# EAGLE schematic Schematic (EAGLE 9.6.2)
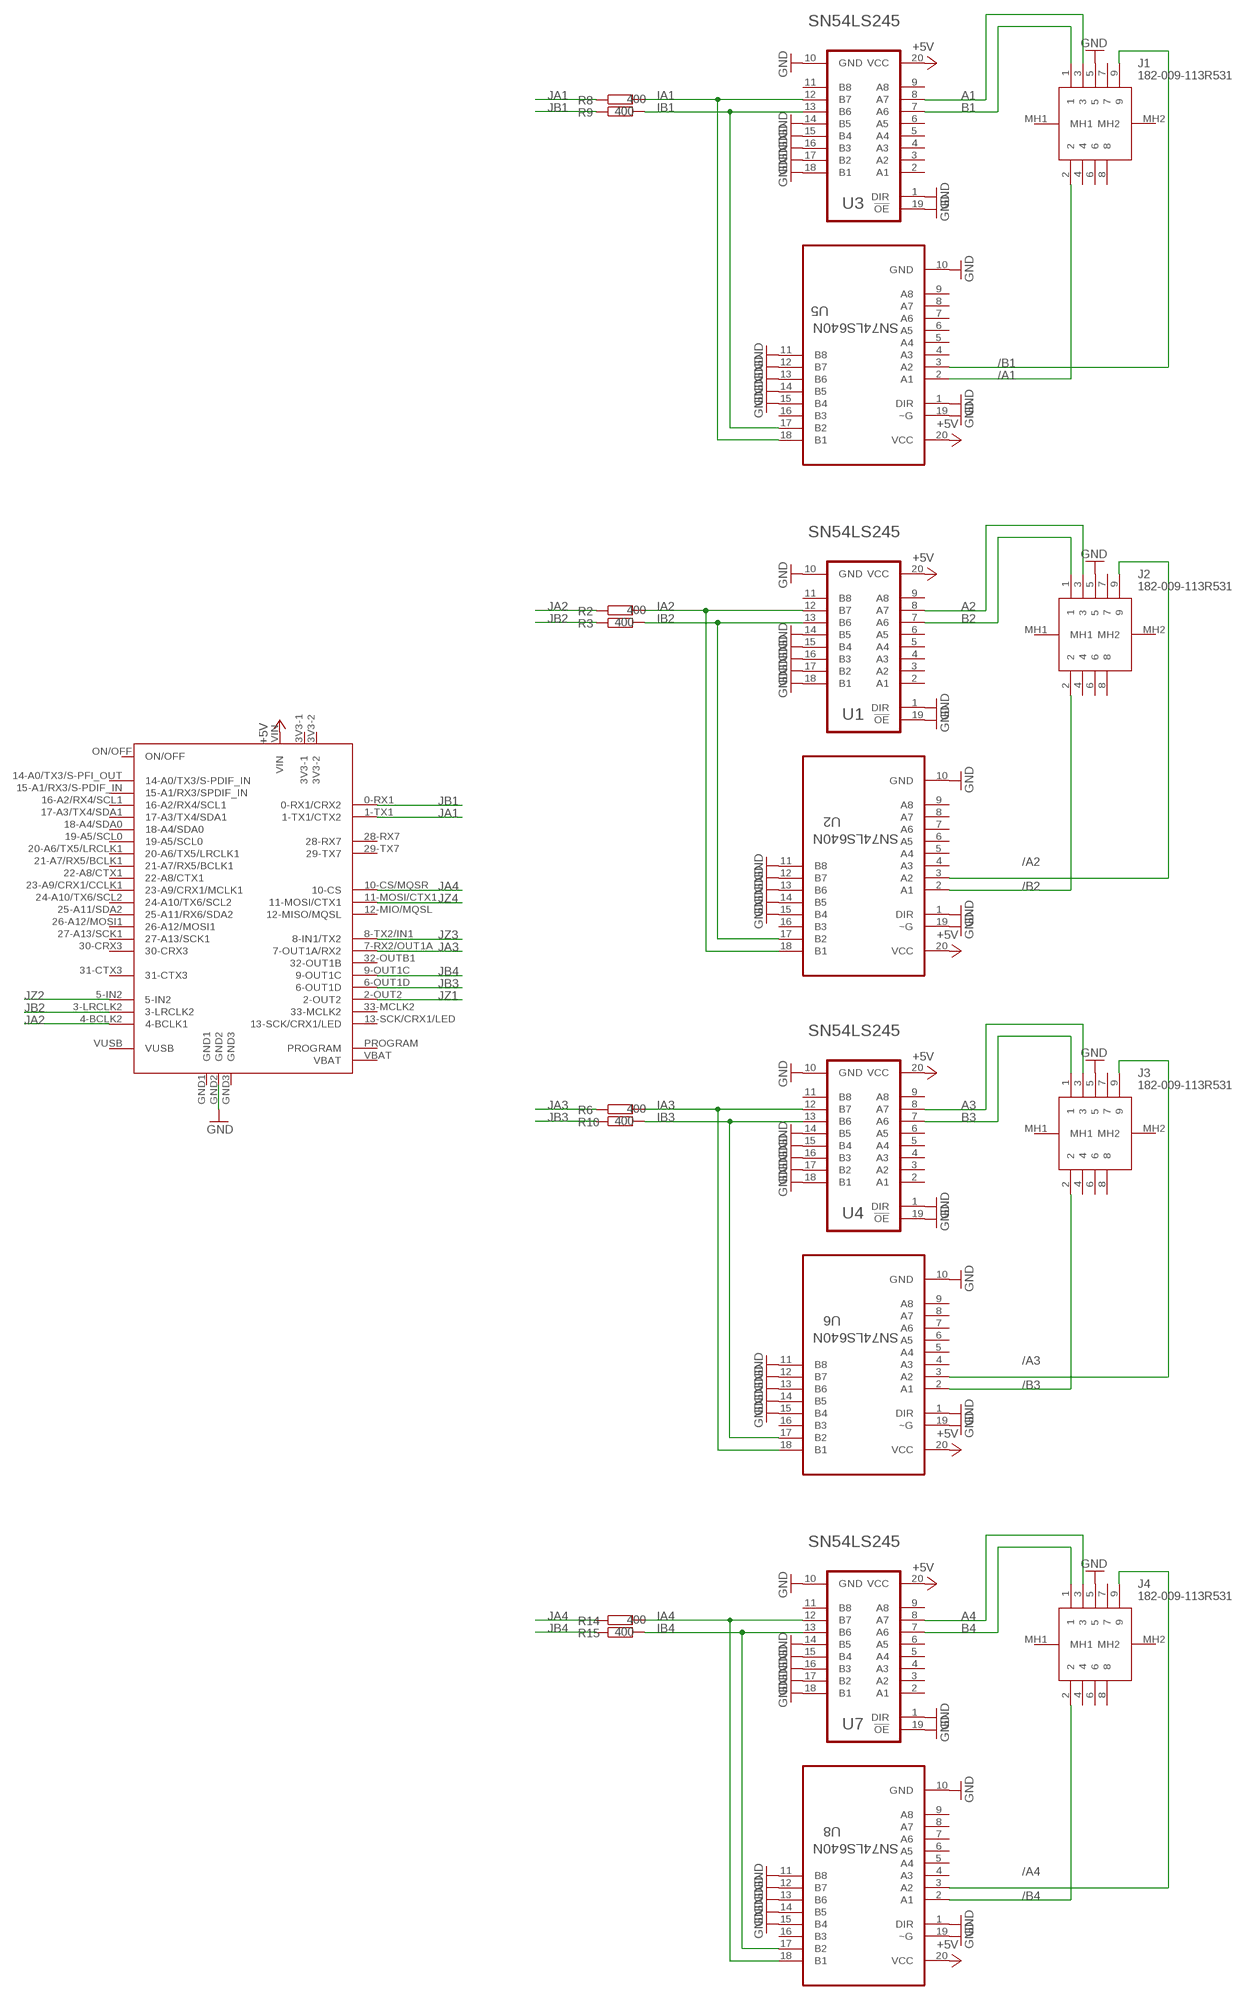
[diagram p0: schematic, sheet 1]

## Parts
J1  182-009-113R531  [182009113R531]
J2  182-009-113R531  [182009113R531]
J3  182-009-113R531  [182009113R531]
J4  182-009-113R531  [182009113R531]
R2  400  R-EU_0204/7  [0204/7]
R3  400  R-EU_0204/7  [0204/7]
R6  400  R-EU_0204/7  [0204/7]
R8  400  R-EU_0204/7  [0204/7]
R9  400  R-EU_0204/7  [0204/7]
R10  400  R-EU_0204/7  [0204/7]
R14  400  R-EU_0204/7  [0204/7]
R15  400  R-EU_0204/7  [0204/7]
U1  TEXAS_INSTRUMENTS_SN54LS245TEXAS_INSTRUMENTS_SN54LS245_0_0  [TEXAS_INSTRUMENTS_SN54LS245_0]
U2  SN74LS640N  [DIP254P762X508-20]
U3  TEXAS_INSTRUMENTS_SN54LS245TEXAS_INSTRUMENTS_SN54LS245_0_0  [TEXAS_INSTRUMENTS_SN54LS245_0]
U4  TEXAS_INSTRUMENTS_SN54LS245TEXAS_INSTRUMENTS_SN54LS245_0_0  [TEXAS_INSTRUMENTS_SN54LS245_0]
U5  SN74LS640N  [DIP254P762X508-20]
U6  SN74LS640N  [DIP254P762X508-20]
U7  TEXAS_INSTRUMENTS_SN54LS245TEXAS_INSTRUMENTS_SN54LS245_0_0  [TEXAS_INSTRUMENTS_SN54LS245_0]
U8  SN74LS640N  [DIP254P762X508-20]
U$1  TEENSY40  [TEENSY40]

## Nets
+5V: U1.20(VCC) U2.20(VCC) U3.20(VCC) U4.20(VCC) U5.20(VCC) U6.20(VCC) U7.20(VCC) U8.20(VCC) U$1.VIN
/A1: J1.2 U5.2(A1)
/A2: J2.2 U2.2(A1)
/A3: J3.2 U6.2(A1)
/A4: J4.2 U8.2(A1)
/B1: J1.9 U5.3(A2)
/B2: J2.9 U2.3(A2)
/B3: J3.9 U6.3(A2)
/B4: J4.9 U8.3(A2)
A1: J1.3 U3.8(A7)
A2: J2.3 U1.8(A7)
A3: J3.3 U4.8(A7)
A4: J4.3 U7.8(A7)
B1: J1.1 U3.7(A6)
B2: J2.1 U1.7(A6)
B3: J3.1 U4.7(A6)
B4: J4.1 U7.7(A6)
GND: J1.5 J2.5 J3.5 J4.5 U1.1(DIR) U1.10(GND) U1.14(B5) U1.15(B4) U1.16(B3) U1.17(B2) U1.18(B1) U1.19(!OE!) U2.1(DIR) U2.10(GND) U2.11(B8) U2.12(B7) U2.13(B6) U2.14(B5) U2.15(B4) U2.19(~G) U3.1(DIR) U3.10(GND) U3.14(B5) U3.15(B4) U3.16(B3) U3.17(B2) U3.18(B1) U3.19(!OE!) U4.1(DIR) U4.10(GND) U4.14(B5) U4.15(B4) U4.16(B3) U4.17(B2) U4.18(B1) U4.19(!OE!) U5.1(DIR) U5.10(GND) U5.11(B8) U5.12(B7) U5.13(B6) U5.14(B5) U5.15(B4) U5.19(~G) U6.1(DIR) U6.10(GND) U6.11(B8) U6.12(B7) U6.13(B6) U6.14(B5) U6.15(B4) U6.19(~G) U7.1(DIR) U7.10(GND) U7.14(B5) U7.15(B4) U7.16(B3) U7.17(B2) U7.18(B1) U7.19(!OE!) U8.1(DIR) U8.10(GND) U8.11(B8) U8.12(B7) U8.13(B6) U8.14(B5) U8.15(B4) U8.19(~G) U$1.GND2
IA1: R8.2 U3.12(B7) U5.18(B1)
IA2: R2.2 U1.12(B7) U2.18(B1)
IA3: R6.2 U4.12(B7) U6.18(B1)
IA4: R14.2 U7.12(B7) U8.18(B1)
IB1: R9.2 U3.13(B6) U5.17(B2)
IB2: R3.2 U1.13(B6) U2.17(B2)
IB3: R10.2 U4.13(B6) U6.17(B2)
IB4: R15.2 U7.13(B6) U8.17(B2)
JA1: R8.1 U$1.1-TX1(1-TX1/CTX2)
JA2: R2.1 U$1.4-BCLK2(4-BCLK1)
JA3: R6.1 U$1.7-RX2/OUT1A(7-OUT1A/RX2)
JA4: R14.1 U$1.10-CS/MQSR(10-CS)
JB1: R9.1 U$1.0-RX1(0-RX1/CRX2)
JB2: R3.1 U$1.3-LRCLK2
JB3: R10.1 U$1.6-OUT1D
JB4: R15.1 U$1.9-OUT1C
JZ1: U$1.2-OUT2
JZ2: U$1.5-IN2
JZ3: U$1.8-TX2/IN1(8-IN1/TX2)
JZ4: U$1.11-MOSI/CTX1
Unconnected: J1.4 J1.6 J1.7 J1.8 J1.MH1 J1.MH2 J2.4 J2.6 J2.7 J2.8 J2.MH1 J2.MH2 J3.4 J3.6 J3.7 J3.8 J3.MH1 J3.MH2 J4.4 J4.6 J4.7 J4.8 J4.MH1 J4.MH2 U1.2(A1) U1.3(A2) U1.4(A3) U1.5(A4) U1.6(A5) U1.9(A8) U1.11(B8) U2.4(A3) U2.5(A4) U2.6(A5) U2.7(A6) U2.8(A7) U2.9(A8) U2.16(B3) U3.2(A1) U3.3(A2) U3.4(A3) U3.5(A4) U3.6(A5) U3.9(A8) U3.11(B8) U4.2(A1) U4.3(A2) U4.4(A3) U4.5(A4) U4.6(A5) U4.9(A8) U4.11(B8) U5.4(A3) U5.5(A4) U5.6(A5) U5.7(A6) U5.8(A7) U5.9(A8) U5.16(B3) U6.4(A3) U6.5(A4) U6.6(A5) U6.7(A6) U6.8(A7) U6.9(A8) U6.16(B3) U7.2(A1) U7.3(A2) U7.4(A3) U7.5(A4) U7.6(A5) U7.9(A8) U7.11(B8) U8.4(A3) U8.5(A4) U8.6(A5) U8.7(A6) U8.8(A7) U8.9(A8) U8.16(B3) U$1.3V3-1 U$1.3V3-2 U$1.12-MIO/MQSL(12-MISO/MQSL) U$1.13-SCK/CRX1/LED U$1.14-A0/TX3/S-PFI_OUT(14-A0/TX3/S-PDIF_IN) U$1.15-A1/RX3/S-PDIF_IN(15-A1/RX3/SPDIF_IN) U$1.16-A2/RX4/SCL1 U$1.17-A3/TX4/SDA1 U$1.18-A4/SDA0 U$1.19-A5/SCL0 U$1.20-A6/TX5/LRCLK1 U$1.21-A7/RX5/BCLK1 U$1.22-A8/CTX1 U$1.23-A9/CRX1/CCLK1(23-A9/CRX1/MCLK1) U$1.24-A10/TX6/SCL2 U$1.25-A11/SDA2(25-A11/RX6/SDA2) U$1.26-A12/MOSI1 U$1.27-A13/SCK1 U$1.28-RX7 U$1.29-TX7 U$1.30-CRX3 U$1.31-CTX3 U$1.32-OUTB1(32-OUT1B) U$1.33-MCLK2 U$1.GND1 U$1.GND3 U$1.ON/OFF U$1.PROGRAM U$1.VBAT U$1.VUSB

## Library data of the parts
J1-J4 = SamacSys_Parts:182-009-113R531: NORCOMP - 182-009-113R531 - D SUB, PLUG, SOLDER, RIGHT ANGLE, 9WAY Source: Datasheet <https://www.norcomp.net/rohspdfs/Connectors/18Y/182/182-yyy-113Ryy1.pdf>; DESCRIPTION: NORCOMP - 182-009-113R531 - D SUB, PLUG, SOLDER, RIGHT ANGLE, 9WAY; HEIGHT: 12.55mm; MANUFACTURER_NAME: NorComp; MANUFACTURER_PART_NUMBER: 182-009-113R531; MOUSER_PART_NUMBER: 636-182-009-113R531; MOUSER_PRICE-STOCK: https://www.mouser.co.uk/ProductDetail/NorComp/182-009-113R531?qs=QVSbBo1cBBTeggoiUtmnzA%3D%3D
R2 R3 R6 R8-R10 R14 R15 = Teknikfag komponenter:R-EU_: RESISTOR, European symbol; SPICEPREFIX: R
U1 U3 U4 U7 = SN54LS245:TEXAS_INSTRUMENTS_SN54LS245: TI-SN_CDX4XXXXXX245XX_6XXX-20; CIIVA_IDS: 2979989; DATASHEET_VERSION: SDLS146A; FOOTPRINT_VARIANT_NAME_0: Manufacturer Recommended; IMPORTED: yes; IMPORTED_FROM: vault; IMPORT_TS: 1521844992; INPUT_TYPE: TTL; MF: Texas Instruments; MPN: SN54LS245; OPERATING_TEMPERATURE_RANGEC: -55 to 125; OUTPUT_TYPE: TTL; PACKAGE: J0020A; PREFIX: U; RATING: Military; RELEASE_DATE: 1459330087; SCHMITT_TRIGGER: No; TECHNOLOGY_FAMILY: LS; VAULT_GUID: 8A10EBEE-09F4-4ECB-9B30-69BD58852236; VAULT_REVISION: 008853CE-E1C2-4D4E-AAEB-0AEE99FFA7D1; VCC_MAX_V: 5.5; VCC_MIN_V: 4.5
U2 U5 U6 U8 = SN74LS640N:SN74LS640N: OCTAL BUS TRANSCEIVRS Check prices <https://pricing.snapeda.com/parts/SN74LS640N/Texas%20Instruments/view-part?ref=eda>; AVAILABILITY: Warning; DESCRIPTION: Octal bus transceivers 20-PDIP 0 to 70; MF: Texas Instruments; MP: SN74LS640N; PACKAGE: PDIP-20 Texas Instruments; PRICE: None; PURCHASE-URL: https://pricing.snapeda.com/search/part/SN74LS640N/?ref=eda
U$1 = teensy:TEENSY40: Teensy 4.0 device including POGO pins for pins 24 - 33, but not yet pins for D+ and D-. Symbol layout is what works for me and may not suite everyone... that can be added or additional symbols can be created to be used in a modilied davie name.